# EAGLE design Covers (EAGLE 9.2.2)
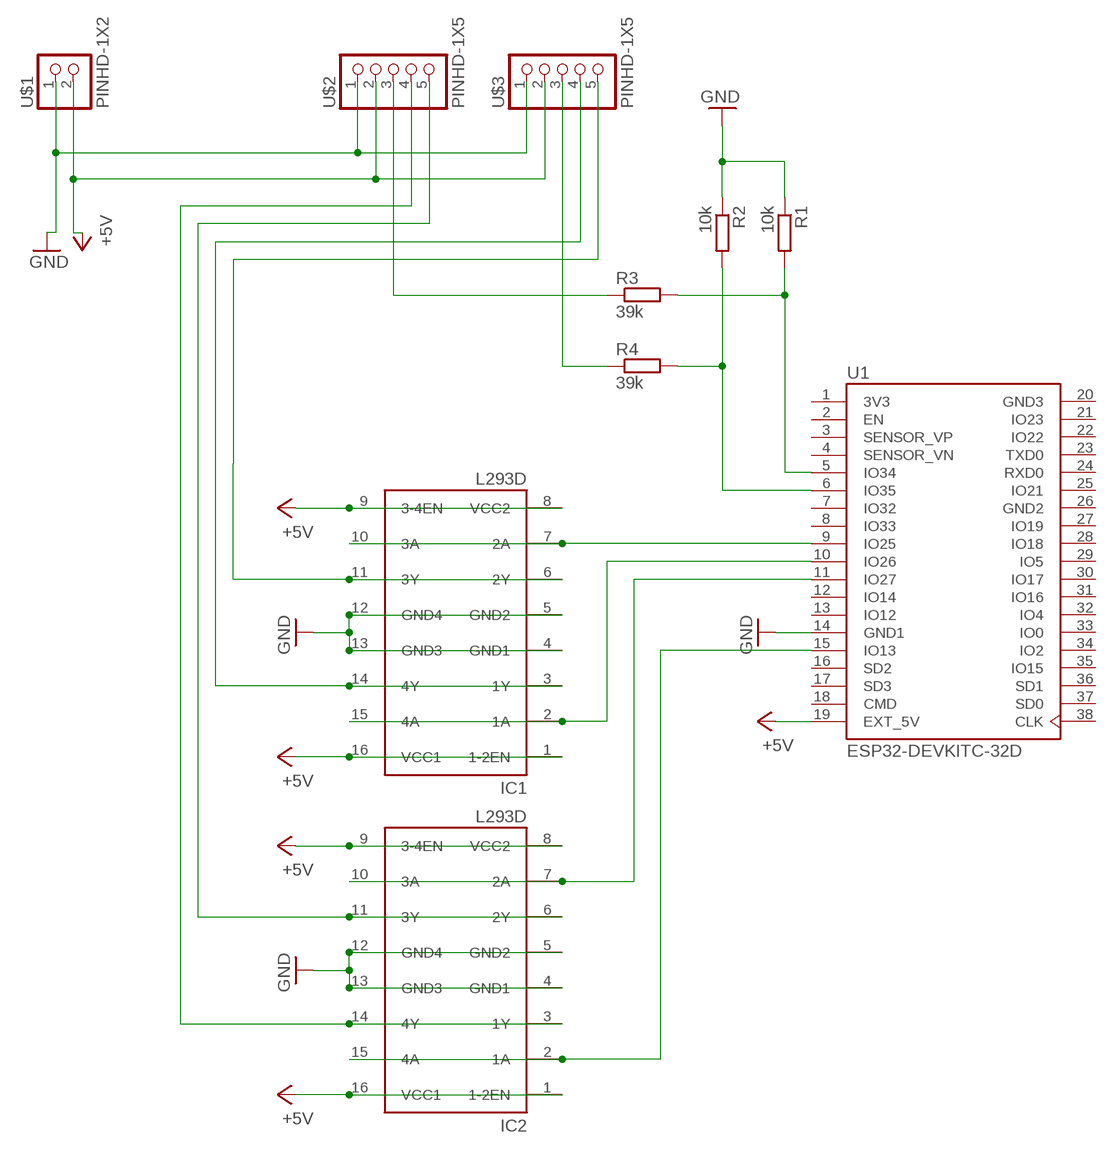
[diagram p0: schematic, sheet 1]

## Parts
IC1  L293D  [DIL16]
IC2  L293D  [DIL16]
R1  10k  R-EU_0207/10  [0207/10]
R2  10k  R-EU_0207/10  [0207/10]
R3  39k  R-EU_0207/10  [0207/10]
R4  39k  R-EU_0207/10  [0207/10]
U1  ESP32-DEVKITC-32D  [MODULE_ESP32-DEVKITC-32D]
U$1  PINHD-1X2  [1X02]
U$2  PINHD-1X5  [1X05]
U$3  PINHD-1X5  [1X05]

## Nets
+5V: IC1.1(1-2EN) IC1.8(VCC2) IC1.9(3-4EN) IC1.16(VCC1) IC2.1(1-2EN) IC2.8(VCC2) IC2.9(3-4EN) IC2.16(VCC1) U1.19(EXT_5V) U$1.2 U$2.2 U$3.2
GND: IC1.4(GND1) IC1.5(GND2) IC1.12(GND4) IC1.13(GND3) IC2.4(GND1) IC2.5(GND2) IC2.12(GND4) IC2.13(GND3) R1.1 R2.1 U1.14(GND1) U$1.1 U$2.1 U$3.1
N$1: IC1.2(1A) IC1.15(4A) U1.10(IO26)
N$2: IC1.6(2Y) IC1.11(3Y) U$3.5
N$3: IC2.6(2Y) IC2.11(3Y) U$2.5
N$4: IC1.3(1Y) IC1.14(4Y) U$3.4
N$5: R2.2 R4.2 U1.6(IO35)
N$6: R1.2 R3.2 U1.5(IO34)
N$7: R4.1 U$3.3
N$8: R3.1 U$2.3
N$9: IC2.3(1Y) IC2.14(4Y) U$2.4
N$10: IC2.2(1A) IC2.15(4A) U1.15(IO13)
N$12: IC1.7(2A) IC1.10(3A) U1.9(IO25)
N$15: IC2.7(2A) IC2.10(3A) U1.11(IO27)
Unconnected: U1.2(EN) U1.3(SENSOR_VP) U1.4(SENSOR_VN) U1.7(IO32) U1.8(IO33) U1.12(IO14) U1.13(IO12) U1.16(SD2) U1.17(SD3) U1.18(CMD) U1.21(IO23) U1.22(IO22) U1.23(TXD0) U1.24(RXD0) U1.25(IO21) U1.27(IO19) U1.28(IO18) U1.29(IO5) U1.30(IO17) U1.31(IO16) U1.32(IO4) U1.33(IO0) U1.34(IO2) U1.35(IO15) U1.36(SD1) U1.37(SD0) U1.38(CLK)

## Power pins joined to a net without a drawn wire
3V3: U1.1(3V3)
GND2: U1.26(GND2)
GND3: U1.20(GND3)

## Library data of the parts
IC1 IC2 = st-microelectronics:L293D: PUSH-PULL 4 CHANNEL DRIVER; MPN: L293D; OC_FARNELL: 9589619; OC_NEWARK: 56P8249
R1-R4 = resistor:R-EU_: RESISTOR, European symbol
U1 = ESP32-DEVKITC-32D:ESP32-DEVKITC-32D: Eval Board For Esp-Wroom-32 Check prices <https://pricing.snapeda.com/parts/ESP32-DEVKITC-32D/Espressif%20Systems/view-part?ref=eda>; AVAILABILITY: Warning; DESCRIPTION: EVAL BOARD FOR ESP-WROOM-32; MF: Espressif Systems; MP: ESP32-DEVKITC-32D; PACKAGE: None; PRICE: None; PURCHASE-URL: https://pricing.snapeda.com/search/part/ESP32-DEVKITC-32D/?ref=eda
U$1 = Headery:PINHD-1X2
U$2 U$3 = Headery:PINHD-1X5

## Board
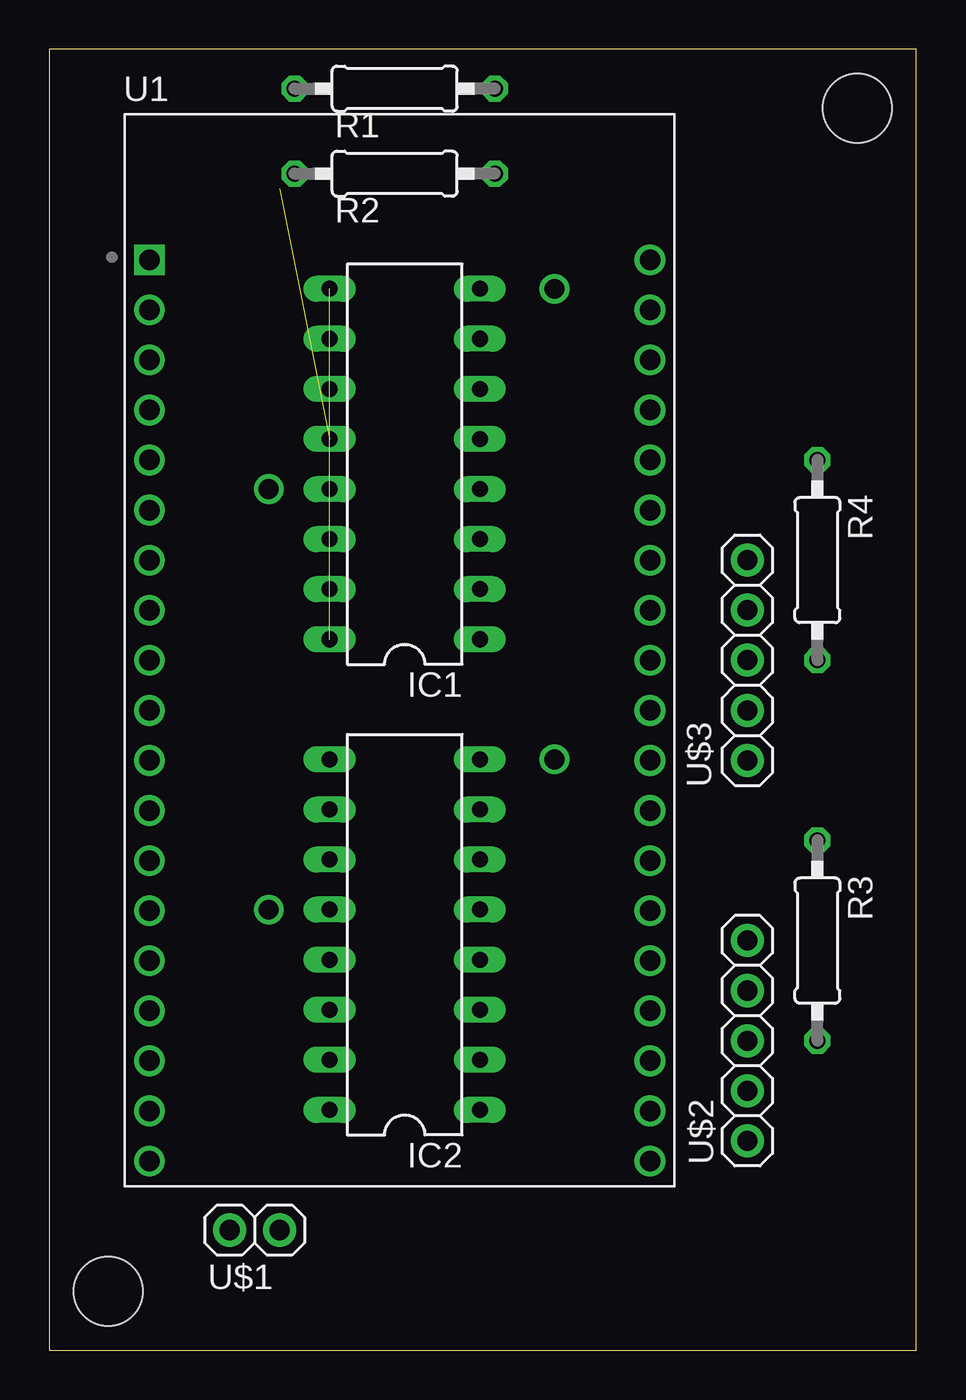
[diagram p1: board, top side]
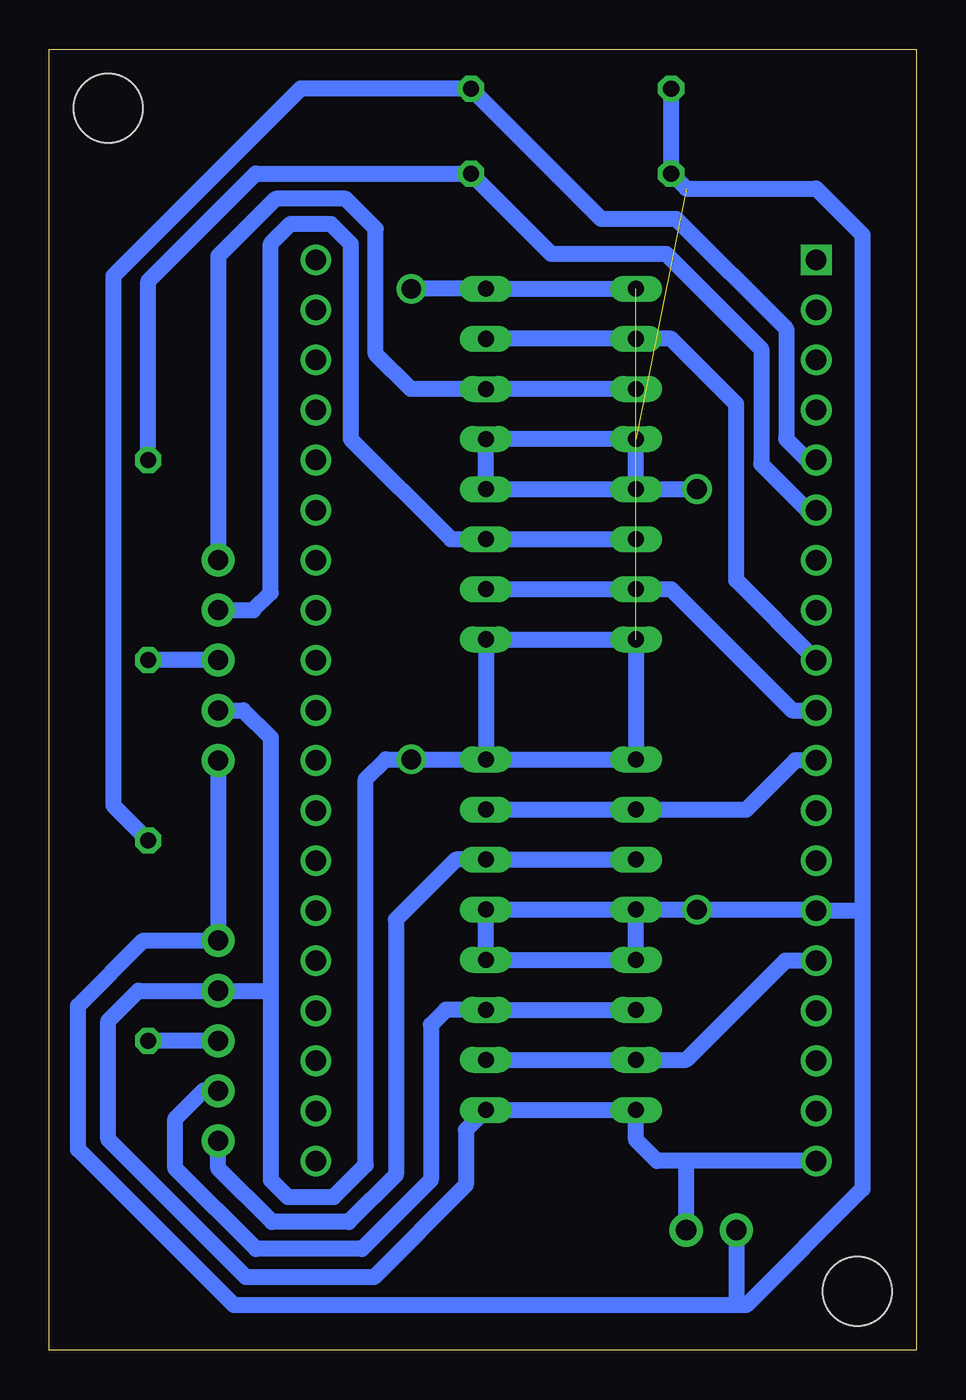
[diagram p2: board, bottom side, seen from below]

Size 44 x 66 mm. Coordinates in mm from the lower left corner, seen from the top.
Outline: 0,0 44,0 44,66 0,66 0,0
Copper layers (1*16): Top 0.035mm / dielectric 1.5mm / Bottom 0.035mm
Design rules "default *": minimum track width 32mil, minimum drill 0.35mm, track to track 10mil, track to pad 10mil, pad to pad 10mil, via to via 10mil, smd to smd 10mil, copper to edge 40mil, drill to drill 6mil, minimum pad ring 10mil, minimum via ring 8mil, stop-mask expansion 4mil, vias tented up to drill 0mil, thermal gap 10mil
Holes 3.5 mm at 3,3 41,63

### Footprints (pad centres in the part's own frame; a part is rotated, then mirrored left to right if it is on the bottom)
DIL16 = drill 0.813 long: 1 -8.89,-3.81; 2 -6.35,-3.81; 3 -3.81,-3.81; 4 -1.27,-3.81; 5 1.27,-3.81; 6 3.81,-3.81; 7 6.35,-3.81; 8 8.89,-3.81; 9 8.89,3.81; 10 6.35,3.81; 11 3.81,3.81; 12 1.27,3.81; 13 -1.27,3.81; 14 -3.81,3.81; 15 -6.35,3.81; 16 -8.89,3.81
0207/10 = drill 0.813 octagon: 1 -5.08,0; 2 5.08,0
MODULE_ESP32-DEVKITC-32D = drill 1.04 square: 1 -12.7,19.76 | drill 1.04: 2 -12.7,17.22; 3 -12.7,14.68; 4 -12.7,12.14; 5 -12.7,9.6; 6 -12.7,7.06; 7 -12.7,4.52; 8 -12.7,1.98; 9 -12.7,-0.56; 10 -12.7,-3.1; 11 -12.7,-5.64; 12 -12.7,-8.18; 13 -12.7,-10.72; 14 -12.7,-13.26; 15 -12.7,-15.8; 16 -12.7,-18.34; 17 -12.7,-20.88; 18 -12.7,-23.42; 19 -12.7,-25.96; 20 12.7,19.76; 21 12.7,17.22; 22 12.7,14.68; 23 12.7,12.14; 24 12.7,9.6; 25 12.7,7.06; 26 12.7,4.52; 27 12.7,1.98; 28 12.7,-0.56; 29 12.7,-3.1; 30 12.7,-5.64; 31 12.7,-8.18; 32 12.7,-10.72; 33 12.7,-13.26; 34 12.7,-15.8; 35 12.7,-18.34; 36 12.7,-20.88; 37 12.7,-23.42; 38 12.7,-25.96
1X02 = drill 1.016 pad 1.676: 1 -1.27,0; 2 1.27,0
1X05 = drill 1.016 pad 1.676: 1 -5.08,0; 2 -2.54,0; 3 0,0; 4 2.54,0; 5 5.08,0

### Placement (x,y rotation side)
IC1  18.03,44.96 90 top
IC2  18.03,21.08 90 top
R1  17.53,64.01 0 top
R2  17.53,59.69 0 top
R3  38.98,20.78 90 top
R4  38.98,40.09 90 top
U1  17.78,35.56 0 top
U$1  10.41,6.1 0 top
U$2  35.42,15.7 270 top
U$3  35.42,35.01 90 top

### Tracks (layer width: path | path; a pad name or v marks a point on that pad's centre or on a via)
+5V  (via drill 1)  (1 unrouted)
  Bottom 0.813: IC2.8 IC2.9 IC1.16 IC1.1 IC2.8 | IC1.9 IC1.8 v25.63,53.85 | U1.19 11.68,9.6 | 11.68,9.6 13.16,9.6 14.22,10.67 IC2.16 IC2.1 22.86,11.18 22.86,8.38 27.53,3.71 34.02,3.71 41.01,10.7 41.01,16.72 39.49,18.24 U$2.2 32.82,18.24 32.77,18.3 | IC2.8 v25.63,29.97 26.92,29.97 27.94,28.96 27.94,9.4 29.56,7.77 31.9,7.77 32.77,8.64 32.77,18.3 | U$3.2 34.15,32.47 32.77,31.08 32.77,18.3 | U$1.2 11.68,9.6
GND  (via drill 1)  (1 unrouted)
  Bottom 0.813: IC2.12 IC2.5 IC2.4 IC2.13 IC2.12 | IC1.13 IC1.4 IC1.5 IC1.12 IC1.13 | 14.17,22.3 IC2.12 | 3,22.3 2.79,22.1 | 3,22.3 U1.14 5.13,22.35 v11.13,22.35 IC2.12 | 3,22.3 2.74,22.3 | 9.14,2.29 8.64,2.29 2.74,8.18 2.74,22.3 | 9.14,2.29 34.63,2.29 42.53,10.19 42.53,17.48 39.23,20.78 U$2.1 U$3.1 | U$1.1 9.14,2.29 | R1.1 R2.1 11.68,58.93 5.08,58.93 2.74,56.59 2.74,22.3 | IC1.13 v11.13,43.69
N$1
  Bottom 0.813: IC1.2 IC1.15 12.45,38.61 6.3,32.46 U1.10
N$2
  Bottom 0.813: IC1.11 IC1.6 25.65,48.77 27.43,50.55 27.43,56.9 28.96,58.42 32.51,58.42 35.42,55.51 U$3.5
N$3
  Bottom 0.813: IC2.11 IC2.6 23.37,24.89 26.42,21.84 26.42,8.89 28.8,6.5 32.7,6.5 35.42,9.22 U$2.5
N$4
  Bottom 0.813: IC1.14 IC1.3 23.62,41.15 28.7,46.23 28.7,56.13 29.72,57.15 31.75,57.15 32.77,56.13 32.77,38.42 33.64,37.55 U$3.4
N$5
  Bottom 0.813: U1.6 5.54,42.62 7.87,44.96 7.87,50.8 12.7,55.63 18.54,55.63 R2.2 33.53,59.69 38.98,54.24 R4.2
N$6
  Bottom 0.813: U1.5 5.54,45.16 6.6,46.23 6.6,51.82 12.19,57.4 16,57.4 R1.2 31.24,64.01 40.76,54.49 40.76,27.64 R3.2
N$7
  Bottom 0.813: U$3.3 R4.1
N$8
  Bottom 0.813: U$2.3 R3.1
N$9
  Bottom 0.813: IC2.14 IC2.3 23.88,17.27 24.64,16.51 24.64,8.64 28.14,5.13 33.51,5.13 37.6,9.22 37.6,11.75 36.18,13.16 U$2.4
N$10
  Bottom 0.813: U1.15 6.66,19.76 11.68,14.73 IC2.15 IC2.2
N$12
  Bottom 0.813: IC1.7 IC1.10 12.45,51.31 9.14,48.01 9.14,39.06 U1.9
N$15
  Bottom 0.813: IC2.7 IC2.10 8.64,27.43 6.15,29.92 U1.11